# EAGLE schematic RC_Engine_Sound_ESP32 (EAGLE 7.6.0)
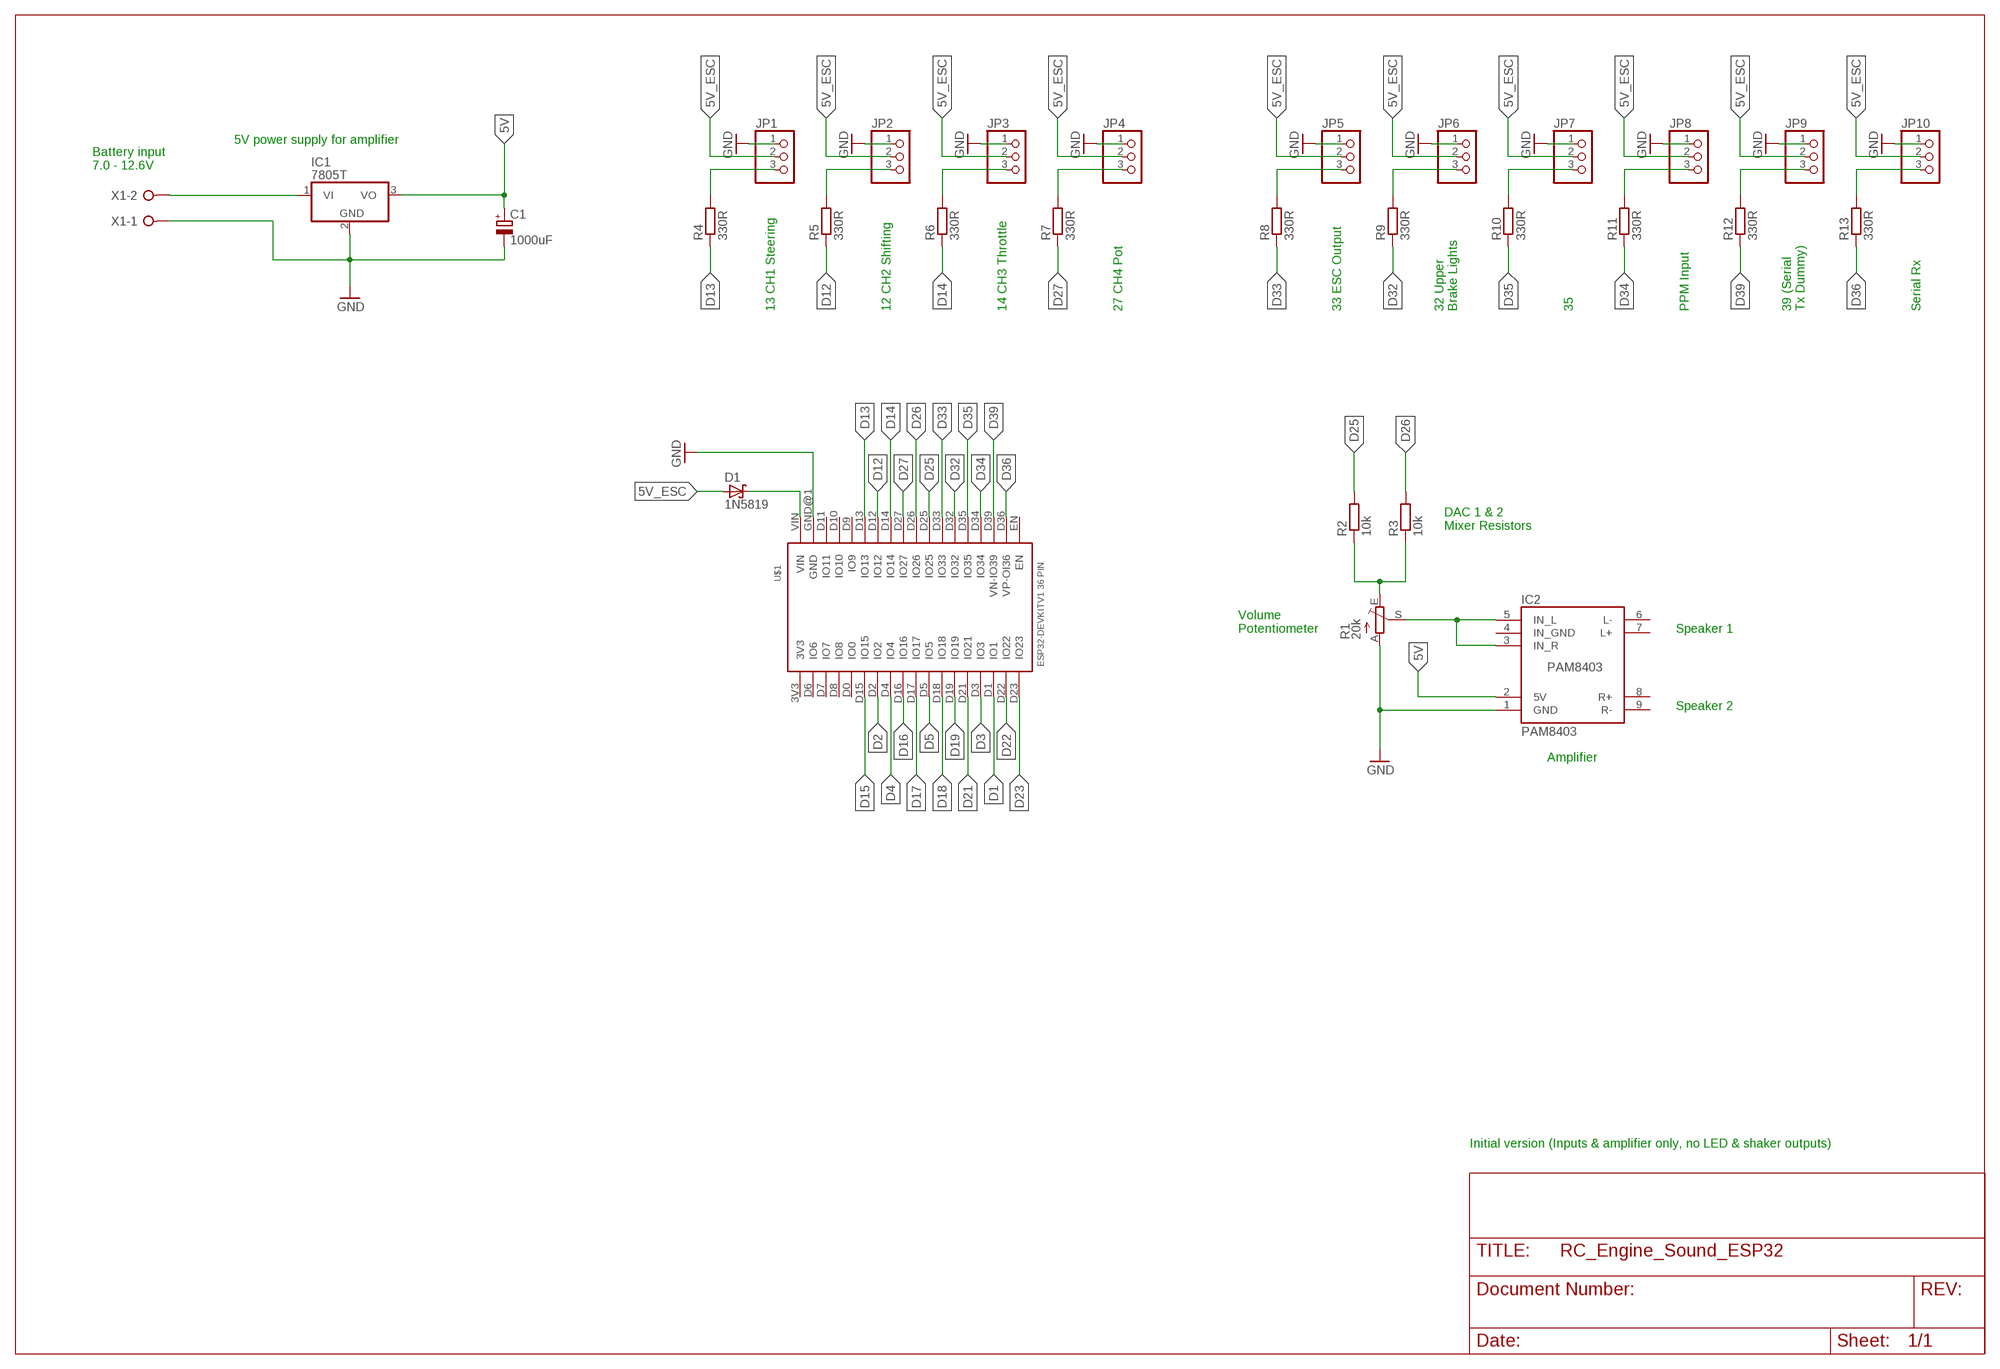
[diagram p0: schematic, sheet 1]

## Parts
C1  1000uF  CPOL-EUE5-10.5  [E5-10,5]
D1  1N5819  SCHOTTKY-DIODEDO35-7  [DO35-7]
IC1  7805T  [TO220H]
IC2  PAM8403  [PAM8403]
JP1  PINHD-1X3  [1X03]
JP2  PINHD-1X3  [1X03]
JP3  PINHD-1X3  [1X03]
JP4  PINHD-1X3  [1X03]
JP5  PINHD-1X3  [1X03]
JP6  PINHD-1X3  [1X03]
JP7  PINHD-1X3  [1X03]
JP8  PINHD-1X3  [1X03]
JP9  PINHD-1X3  [1X03]
JP10  PINHD-1X3  [1X03]
R1  20k  TRIM_EU-S64W  [S64W]
R2  10k  R-EU_0207/10  [0207/10]
R3  10k  R-EU_0207/10  [0207/10]
R4  330R  R-EU_0207/2V  [0207/2V]
R5  330R  R-EU_0207/2V  [0207/2V]
R6  330R  R-EU_0207/2V  [0207/2V]
R7  330R  R-EU_0207/2V  [0207/2V]
R8  330R  R-EU_0207/2V  [0207/2V]
R9  330R  R-EU_0207/2V  [0207/2V]
R10  330R  R-EU_0207/2V  [0207/2V]
R11  330R  R-EU_0207/2V  [0207/2V]
R12  330R  R-EU_0207/2V  [0207/2V]
R13  330R  R-EU_0207/2V  [0207/2V]
U$1  ESP32DEVKITV1  [ESP32-DEVKITV1]
X1  W237-02P  [W237-132]

## Nets
5V: C1.+ IC1.3(VO) IC2.2(5V)
5V_ESC: D1.A JP1.2 JP2.2 JP3.2 JP4.2 JP5.2 JP6.2 JP7.2 JP8.2 JP9.2 JP10.2
D1: U$1.D1(IO1)
D2: U$1.D2(IO2)
D3: U$1.D3(IO3)
D4: U$1.D4(IO4)
D5: U$1.D5(IO5)
D12: R5.1 U$1.D12(IO12)
D13: R4.1 U$1.D13(IO13)
D14: R6.1 U$1.D14(IO14)
D15: U$1.D15(IO15)
D16: U$1.D16(IO16)
D17: U$1.D17(IO17)
D18: U$1.D18(IO18)
D19: U$1.D19(IO19)
D21: U$1.D21(IO21)
D22: U$1.D22(IO22)
D23: U$1.D23(IO23)
D25: R2.2 U$1.D25(IO25)
D26: R3.2 U$1.D26(IO26)
D27: R7.1 U$1.D27(IO27)
D32: R9.1 U$1.D32(IO32)
D33: R8.1 U$1.D33(IO33)
D34: R11.1 U$1.D34(IO34)
D35: R10.1 U$1.D35(IO35)
D36: R13.1 U$1.D36(VP-OI36)
D39: R12.1 U$1.D39(VN-IO39)
GND: C1.- IC1.2(GND) IC2.1(GND) JP1.1 JP2.1 JP3.1 JP4.1 JP5.1 JP6.1 JP7.1 JP8.1 JP9.1 JP10.1 R1.A U$1.GND@1(GND) X1.1
N$1: IC2.3(IN_R) IC2.5(IN_L) R1.S
N$2: R1.E R2.1 R3.1
N$3: JP1.3 R4.2
N$4: IC1.1(VI) X1.2
N$5: JP2.3 R5.2
N$6: JP3.3 R6.2
N$7: JP4.3 R7.2
N$8: JP5.3 R8.2
N$9: D1.C U$1.VIN
N$10: JP6.3 R9.2
N$11: JP7.3 R10.2
N$12: JP8.3 R11.2
N$13: JP9.3 R12.2
N$14: JP10.3 R13.2
Unconnected: IC2.4(IN_GND) IC2.6(L-) IC2.7(L+) IC2.8(R+) IC2.9(R-) U$1.3V3 U$1.D0(IO0) U$1.D6(IO6) U$1.D7(IO7) U$1.D8(IO8) U$1.D9(IO9) U$1.D10(IO10) U$1.D11(IO11) U$1.EN

## Notes on the sheet
- 5V power supply for amplifier
- Battery input
  7.0 - 12.6V
- 13 CH1 Steering | 12 CH2 Shifting | 14 CH3 Throttle | 27 CH4 Pot | 33 ESC Output
- 32 Upper
  Brake Lights
- 35 | PPM Input
- 39 (Serial
  Tx Dummy)
- Serial Rx
- DAC 1 & 2
  Mixer Resistors
- Volume
  Potentiometer
- Speaker 1
- Speaker 2
- Amplifier
- Initial version (Inputs & amplifier only, no LED & shaker outputs)

## Library data of the parts
C1 = rcl:CPOL-EU: POLARIZED CAPACITOR, European symbol
D1 = diode:SCHOTTKY-DIODE: Schottky Diode
IC1 = linear:78*: Positive VOLTAGE REGULATOR Source: http://cache.national.com/ds/LM/LM78L05.pdf http://www.fairchildsemi.com/ds/LM/LM7805.pdf
IC2 = 00_custom:PAM8403: 2Channel 3W DC 2.5-5V Class D Amplifier Board
JP1-JP10 = 00_custom_pinhead:PINHD-1X3: PIN HEADER
R1 = pot:TRIM_EU-: POTENTIOMETER
R2-R13 = rcl:R-EU_: RESISTOR, European symbol
U$1 = ESP32-DEVKITV1_36pin:ESP32DEVKITV1
X1 = con-wago-508:W237-02P: WAGO SREW CLAMP; OC_FARNELL: unknown; OC_NEWARK: unknown